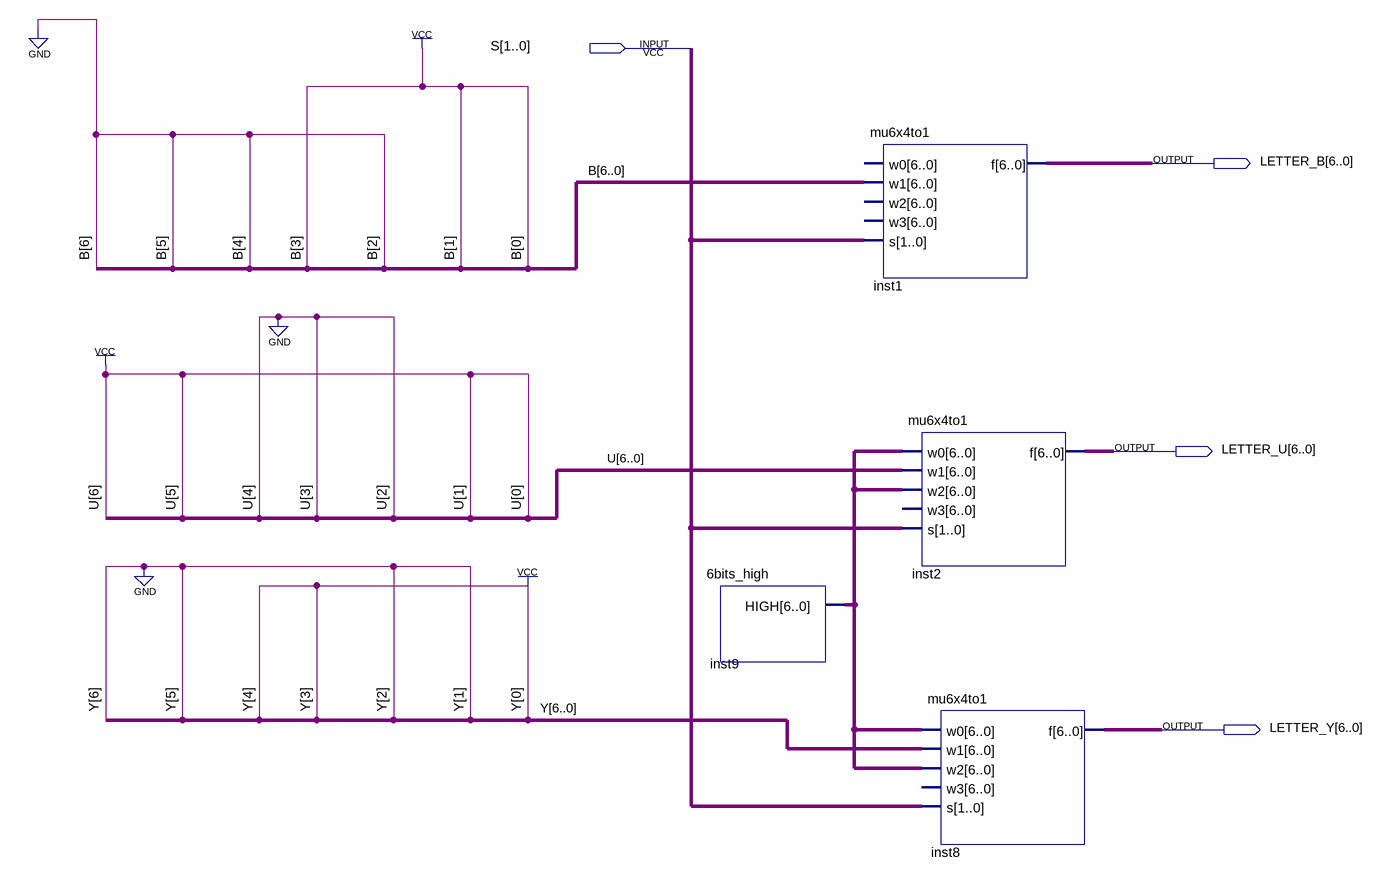
[diagram p0: schematic sheet]
// Quartus schematic buy_symbol.bdf as structural Verilog: 4 symbols, 4 pins
module buy_symbol (
  input  [1:0] S,
  output [6:0] LETTER_B,
  output [6:0] LETTER_U,
  output [6:0] LETTER_Y
);

  wire [6:0] inst9_high;

  \6bits_high  inst9 (.HIGH(inst9_high));
  mu6x4to1 inst1 (.w1(7'b0001011), .s(S), .f(LETTER_B));  // open: w0, w2, w3
  mu6x4to1 inst2 (.w0(inst9_high), .w1(7'b1100011), .w2(inst9_high), .s(S), .f(LETTER_U));  // open: w3
  mu6x4to1 inst8 (.w0(inst9_high), .w1(7'b0011001), .w2(inst9_high), .s(S), .f(LETTER_Y));  // open: w3
endmodule
